# Altium schematic sheet MC.SchDoc
size Letter; SheetNumber: 3; SheetTotal: 5
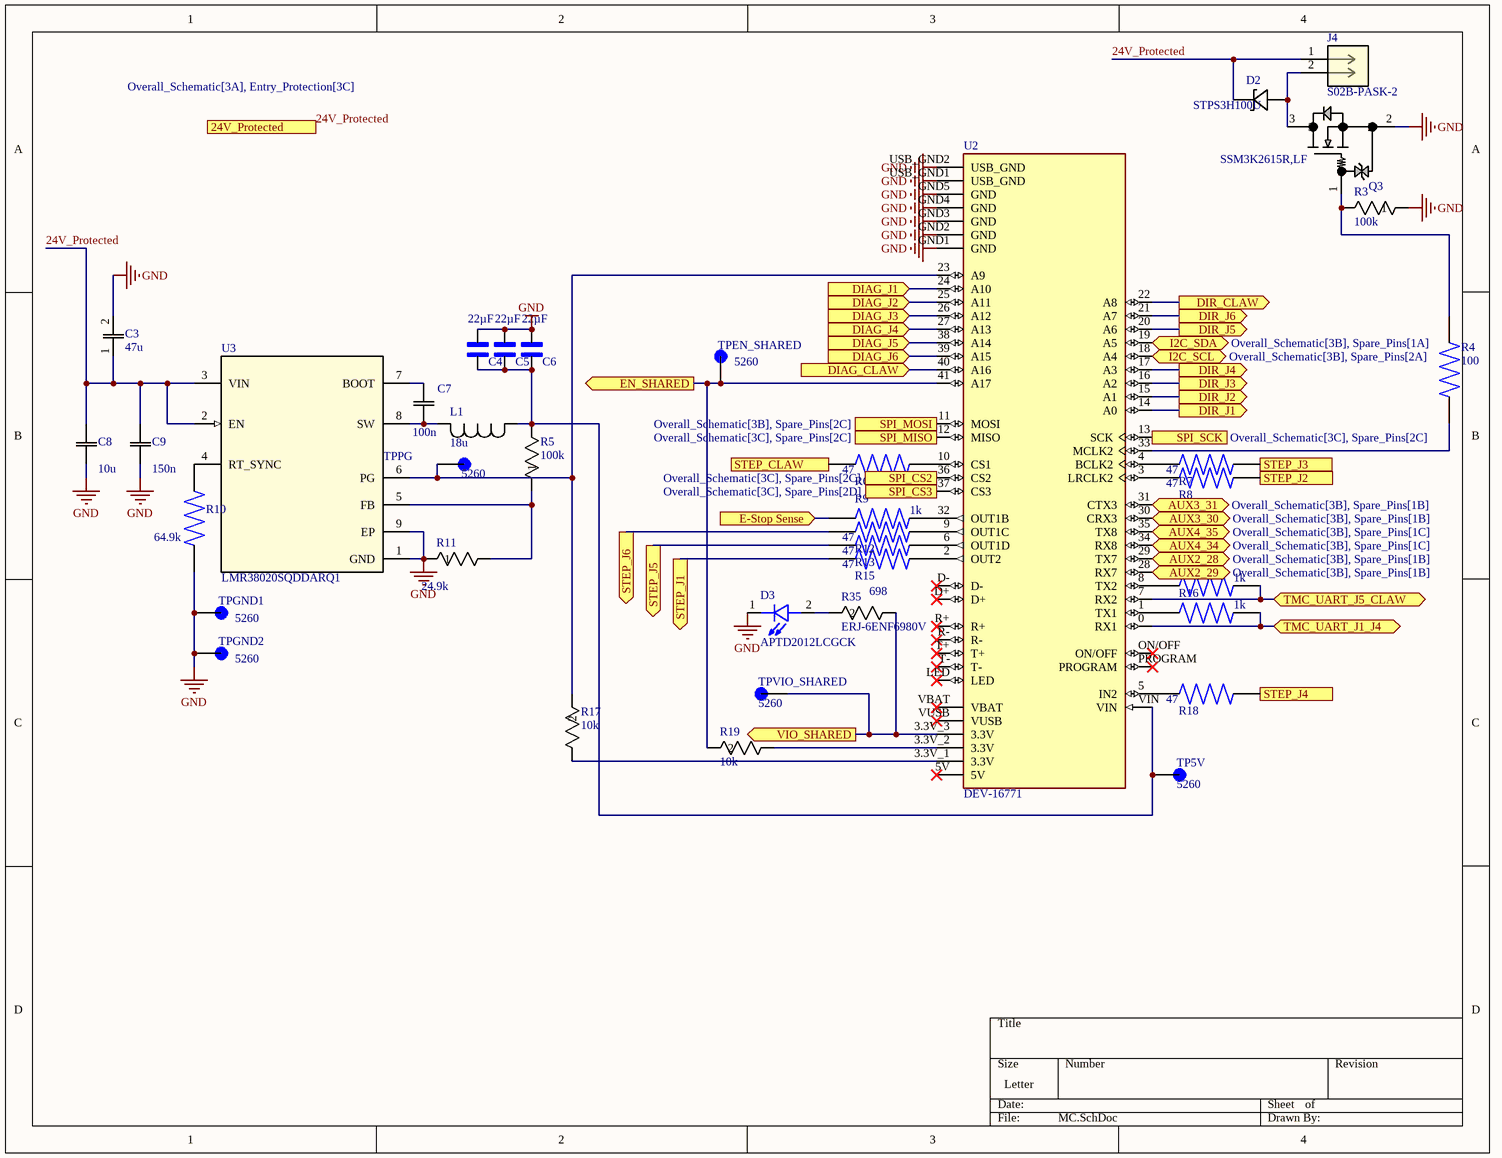
[diagram p0: MC.SchDoc]

## Parts
C3  Capacitance: 47u  [CAP_EEUFC_63X112_PAN]  (hidden comment: EEUFR1J470)
C4  Capacitance: 22µF  [CAPC3225X270N]  (hidden comment: CL32B226KAJNNNE)
C5  Capacitance: 22µF  [CAPC3225X270N]  (hidden comment: CL32B226KAJNNNE)
C6  Capacitance: 22µF  [CAPC3225X270N]  (hidden comment: CL32B226KAJNNNE)
C7  Capacitance: 100n  [CAP_CL_21_SAM]  (hidden comment: CL21B104KCCWPNC)
C8  Capacitance: 10u  [CAP_22201C106MAT2A_KYO]  (hidden comment: 22201C106MAT2A)
C9  Capacitance: 150n  [CAPC220145_140N_KEM]  (hidden comment: C0805C154K1RECTU)
D2  STPS3H100U  [SMB_STM]
D3  APTD2012LCGCK  [LED_APTD2012LCGCK]
J4  S02B-PASK-2  [CONN2_S02B-PASK-2_JST]
L1  Inductance: 18u  [IND_XGL6060_COC]  (hidden comment: XGL6060-183MEC)
Q3  SSM3K2615R,LF  [SOT-23F_TOS]
R3  Resistance: 100k  [RES_ERA3V,3K_PAN]  (hidden comment: ERA-3VEB1003V)
R4  value 100  [RES_ERA3VEB1000V]  (hidden comment: ERA3VEB1000V)
R5  Resistance: 100k  [RES_ERA3V,3K_PAN]  (hidden comment: ERA-3VEB1003V)
R6  Resistance: 47  [RES_ERA3VEB47R0V]  (hidden comment: ERA3VEB47R0V)
R7  Resistance: 47  [RES_ERA3VEB47R0V]  (hidden comment: ERA3VEB47R0V)
R8  Resistance: 47  [RES_ERA3VEB47R0V]  (hidden comment: ERA3VEB47R0V)
R9  value 1k  [RES_ERA3VEB1001V]  (hidden comment: ERA3VEB1001V)
R10  Resistance: 64.9k  [RES_ERJ3EKF6492V]  (hidden comment: ERJ3EKF6492V)
R11  Resistance: 24.9k  [RES_ERA3V,3K_PAN]  (hidden comment: ERA-3VEB2492V)
R12  Resistance: 47  [RES_ERA3VEB47R0V]  (hidden comment: ERA3VEB47R0V)
R13  Resistance: 47  [RES_ERA3VEB47R0V]  (hidden comment: ERA3VEB47R0V)
R14  value 1k  [RES_ERA3VEB1001V]  (hidden comment: ERA3VEB1001V)
R15  Resistance: 47  [RES_ERA3VEB47R0V]  (hidden comment: ERA3VEB47R0V)
R16  value 1k  [RES_ERA3VEB1001V]  (hidden comment: ERA3VEB1001V)
R17  Resistance: 10k  [RC0603N_PAN]  (hidden comment: ERJ-3EKF1002V)
R18  Resistance: 47  [RES_ERA3VEB47R0V]  (hidden comment: ERA3VEB47R0V)
R19  Resistance: 10k  [RC0603N_PAN]  (hidden comment: ERJ-3EKF1002V)
R35  ERJ-6ENF6980V  Resistance: 698  [RC0805N_PAN]
TP5V  5260  [KEYSTONE_5260]
TPEN_SHARED  5260  [KEYSTONE_5260]
TPGND1  5260  [KEYSTONE_5260]
TPGND2  5260  [KEYSTONE_5260]
TPPG  5260  [KEYSTONE_5260]
TPVIO_SHARED  5260  [KEYSTONE_5260]
U2  DEV-16771  [MODULE_DEV-16771]
U3  LMR38020SQDDARQ1  [DDA0008E-IPC_A]

## Ports
24V_Protected (in, see Overall_Schematic[3A], Entry_Protection[3C]), AUX2_28 (bidir, see Overall_Schematic[3B], Spare_Pins[1B]), AUX2_29 (bidir, see Overall_Schematic[3B], Spare_Pins[1B]), AUX3_30 (bidir, see Overall_Schematic[3B], Spare_Pins[1B]), AUX3_31 (bidir, see Overall_Schematic[3B], Spare_Pins[1B]), AUX4_34 (bidir, see Overall_Schematic[3B], Spare_Pins[1C]), AUX4_35 (bidir, see Overall_Schematic[3B], Spare_Pins[1C]), DIAG_CLAW (in, see Overall_Schematic[3C], Ｄｒｉｖｅｒｓ[4C]), DIAG_J1 (in, see Overall_Schematic[3B], Ｄｒｉｖｅｒｓ[1B]), DIAG_J2 (in, see Overall_Schematic[3C], Ｄｒｉｖｅｒｓ[2B]), DIAG_J3 (in, see Overall_Schematic[3C], Ｄｒｉｖｅｒｓ[3B]), DIAG_J4 (in, see Overall_Schematic[3C], Ｄｒｉｖｅｒｓ[4B]), DIAG_J5 (in, see Overall_Schematic[3C], Ｄｒｉｖｅｒｓ[1D]), DIAG_J6 (in, see Overall_Schematic[3C], Ｄｒｉｖｅｒｓ[2D]), DIR_CLAW (out, see Overall_Schematic[3B], Ｄｒｉｖｅｒｓ[3C]), DIR_J1 (out, see Overall_Schematic[3B], Ｄｒｉｖｅｒｓ[1B]), DIR_J2 (out, see Overall_Schematic[3B], Ｄｒｉｖｅｒｓ[2B]), DIR_J3 (out, see Overall_Schematic[3B], Ｄｒｉｖｅｒｓ[3B]), DIR_J4 (out, see Overall_Schematic[3B], Ｄｒｉｖｅｒｓ[4B]), DIR_J5 (out, see Overall_Schematic[3B], Ｄｒｉｖｅｒｓ[1D]), DIR_J6 (out, see Overall_Schematic[3B], Ｄｒｉｖｅｒｓ[2D]), E-Stop Sense (in, see Overall_Schematic[3A], Entry_Protection[2D]), EN_SHARED (out, see Overall_Schematic[3C], Ｄｒｉｖｅｒｓ[1A]), I2C_SCL (bidir, see Overall_Schematic[3B], Spare_Pins[2A]), I2C_SDA (bidir, see Overall_Schematic[3B], Spare_Pins[1A]), SPI_CS2 (out, see Overall_Schematic[3C], Spare_Pins[2C]), SPI_CS3 (out, see Overall_Schematic[3C], Spare_Pins[2D]), SPI_MISO (in, see Overall_Schematic[3C], Spare_Pins[2C]), SPI_MOSI (out, see Overall_Schematic[3B], Spare_Pins[2C]), SPI_SCK (out, see Overall_Schematic[3C], Spare_Pins[2C]), STEP_CLAW (out, see Overall_Schematic[3B], Ｄｒｉｖｅｒｓ[3C]), STEP_J1 (out, see Overall_Schematic[3A], Ｄｒｉｖｅｒｓ[1B]), STEP_J2 (out, see Overall_Schematic[3A], Ｄｒｉｖｅｒｓ[2B]), STEP_J3 (out, see Overall_Schematic[3A], Ｄｒｉｖｅｒｓ[2B]), STEP_J4 (out, see Overall_Schematic[3A], Ｄｒｉｖｅｒｓ[4B]), STEP_J5 (out, see Overall_Schematic[3A], Ｄｒｉｖｅｒｓ[1D]), STEP_J6 (out, see Overall_Schematic[3A], Ｄｒｉｖｅｒｓ[2D]), TMC_UART_J1_J4 (bidir, see Overall_Schematic[3A], Ｄｒｉｖｅｒｓ[1C]), TMC_UART_J5_CLAW (bidir, see Overall_Schematic[3A], Ｄｒｉｖｅｒｓ[1D]), VIO_SHARED (out, see Overall_Schematic[3C], Spare_Pins[1A], Ｄｒｉｖｅｒｓ[1A])

## Nets
GND: C3.2 C4.2 C5.2 C6.2 C8.1 C9.1 D3.1(C) Q3.2 R3.1 R10.1 R11.1 TPGND1.1(TP) TPGND2.1(TP) U2.GND1(GND) U2.GND2(GND) U2.GND3(GND) U2.GND4(GND) U2.GND5(GND) U2.USB_GND1(USB_GND) U2.USB_GND2(USB_GND) U3.1(GND) U3.9(EP)
24V_Protected: C3.1 C8.2 C9.2 D2.2(A) J4.1 U3.2(EN) U3.3(VIN) ; port 24V_Protected
AUX2_28: U2.29(TX7) ; port AUX2_28
AUX2_29: U2.28(RX7) ; port AUX2_29
AUX3_30: U2.30(CRX3) ; port AUX3_30
AUX3_31: U2.31(CTX3) ; port AUX3_31
AUX4_34: U2.34(RX8) ; port AUX4_34
AUX4_35: U2.35(TX8) ; port AUX4_35
DIAG_CLAW: U2.40(A16) ; port DIAG_CLAW
DIAG_J1: U2.24(A10) ; port DIAG_J1
DIAG_J2: U2.25(A11) ; port DIAG_J2
DIAG_J3: U2.26(A12) ; port DIAG_J3
DIAG_J4: U2.27(A13) ; port DIAG_J4
DIAG_J5: U2.38(A14) ; port DIAG_J5
DIAG_J6: U2.39(A15) ; port DIAG_J6
DIR_CLAW: U2.22(A8) ; port DIR_CLAW
DIR_J1: U2.14(A0) ; port DIR_J1
DIR_J2: U2.15(A1) ; port DIR_J2
DIR_J3: U2.16(A2) ; port DIR_J3
DIR_J4: U2.17(A3) ; port DIR_J4
DIR_J5: U2.20(A6) ; port DIR_J5
DIR_J6: U2.21(A7) ; port DIR_J6
E-Stop Sense: R9.1 ; port E-Stop Sense
EN_SHARED: R19.2 TPEN_SHARED.1(TP) U2.41(A17) ; port EN_SHARED
I2C_SCL: U2.18(A4) ; port I2C_SCL
I2C_SDA: U2.19(A5) ; port I2C_SDA
SPI_CS2: U2.36(CS2) ; port SPI_CS2
SPI_CS3: U2.37(CS3) ; port SPI_CS3
SPI_MISO: U2.12(MISO) ; port SPI_MISO
SPI_MOSI: U2.11(MOSI) ; port SPI_MOSI
SPI_SCK: U2.13(SCK) ; port SPI_SCK
STEP_CLAW: R6.1 ; port STEP_CLAW
STEP_J1: R15.1 ; port STEP_J1
STEP_J2: R8.2 ; port STEP_J2
STEP_J3: R7.2 ; port STEP_J3
STEP_J4: R18.2 ; port STEP_J4
STEP_J5: R13.1 ; port STEP_J5
STEP_J6: R12.1 ; port STEP_J6
TMC_UART_J1_J4: R16.2 U2.0(RX1) ; port TMC_UART_J1_J4
TMC_UART_J5_CLAW: R14.2 U2.7(RX2) ; port TMC_UART_J5_CLAW
VIO_SHARED: R35.1 TPVIO_SHARED.1(TP) U2.3.3V_3(3.3V) ; port VIO_SHARED
NetC4_1: C4.1 C5.1 C6.1 L1.2 R5.2 TP5V.1(TP) U2.VIN
NetC7_1: C7.1 U3.7(BOOT)
NetC7_2: C7.2 L1.1 U3.8(SW)
NetD2_1: D2.1(K) J4.2 Q3.3
NetD3_2: D3.2(A) R35.2
NetQ3_1: Q3.1 R3.2 R4.2
NetR4_1: R4.1 U2.33(MCLK2)
NetR5_1: R5.1 R11.2 U3.5(FB)
NetR6_2: R6.2 U2.10(CS1)
NetR7_1: R7.1 U2.4(BCLK2)
NetR8_1: R8.1 U2.3(LRCLK2)
NetR9_2: R9.2 U2.32(OUT1B)
NetR10_2: R10.2 U3.4(RT_SYNC)
NetR12_2: R12.2 U2.9(OUT1C)
NetR13_2: R13.2 U2.6(OUT1D)
NetR14_1: R14.1 U2.8(TX2)
NetR15_2: R15.2 U2.2(OUT2)
NetR16_1: R16.1 U2.1(TX1)
NetR17_1: R17.1 U2.3.3V_1(3.3V)
NetR17_2: R17.2 TPPG.1(TP) U2.23(A9) U3.6(PG)
NetR18_1: R18.1 U2.5(IN2)
NetR19_1: R19.1 U2.3.3V_2(3.3V)

Not connected (* = marked no-connect by the designer): U2 5V* D+* D-* LED* ON/OFF* PROGRAM* R+* R-* T+* T-* VBAT* VUSB*

## Library data of the parts
C3 = EEUFR1J470: Description; Manufacturer_Name: Panasonic; Copyright: Copyright (C) 2026 Ultra Librarian. All rights reserved.; Manufacturer_Part_Number: EEUFR1J470
C4-C6 = CMP-001-00083-1: 22 ÂµF Â±10% 25V Ceramic Capacitor X7R 1210 (3225 Metric); MF: Samsung Electro-Mechanics; Source: CL32B226KAJNNNE.SchLib; Component Type: Standard; Pins: 2; Case/Package: SMD-2 Samsung; Check_prices: https://www.snapeda.com/parts/CL32B226KAJNNNE/Samsung/view-part/?ref=eda; MP: CL32B226KAJNNNE; Design Item ID: CL32B226KAJNNNE; SnapEDA_Link: https://www.snapeda.com/parts/CL32B226KAJNNNE/Samsung/view-part/?ref=snap
C7 = CL21B104KCCWPNC: No Description Available; Manufacturer_Name: Samsung; Copyright: Copyright (C) 2026 Ultra Librarian. All rights reserved.; Manufacturer_Part_Number: CL21B104KCCWPNC
C8 = 22201C106MAT2A: Description; Manufacturer_Name: KYOCERA AVX; Copyright: Copyright (C) 2026 Ultra Librarian. All rights reserved.; Manufacturer_Part_Number: 22201C106MAT2A
C9 = C0805C154K1RECTU: ESD SMD Comm X7R, Ceramic, 0.15 uF, 10%, 100 VDC, X7R, SMD, MLCC, Temperature Stable, Electro Static Discharge, Class II, 0805; Manufacturer_Name: Kemet; Copyright: Copyright (C) 2026 Ultra Librarian. All rights reserved.; Manufacturer_Part_Number: C0805C154K1RECTU
D2 = STPS3H100U: 100 V, 3 A Schottky rectifier; Manufacturer_Name: STMicroelectronics; Copyright: Copyright (C) 2025 Ultra Librarian. All rights reserved.; Manufacturer_Part_Number: STPS3H100U
D3 = CMP-003-000000-1: Green 570nm LED Indication - Discrete 1.9V 0805 (2012 Metric); MF: Kingbright; Value: *; MP: APTD2012LCGCK; Check_prices: https://www.snapeda.com/parts/APTD2012LCGCK/Kingbright/view-part/?ref=eda; Source: APTD2012LCGCK.SchLib; SnapEDA_Link: https://www.snapeda.com/parts/APTD2012LCGCK/Kingbright/view-part/?ref=snap; Component Type: Standard; Pin Count: 2; Design Item ID: APTD2012LCGCK; Package: 0805 Kingbright
J4 = S02B-PASK-2: Description; Manufacturer_Name: JST; Copyright: Copyright (C) 2026 Ultra Librarian. All rights reserved.; Manufacturer_Part_Number: S02B-PASK-2; RefDes: RefDes; Type: Type
L1 = XGL6060-183MEC: Description; Manufacturer_Name: Coilcraft; Copyright: Copyright (C) 2026 Ultra Librarian. All rights reserved.; Manufacturer_Part_Number: XGL6060-183MEC
Q3 = SSM3K2615R,LF: N-ch MOSFET, 60 V, 2.0 A, 0.3 Î©@10V, SOT-23F; Manufacturer_Name: Toshiba Electronic Devices & Storage Corp.; Copyright: Copyright (C) 2026 Ultra Librarian. All rights reserved.; Manufacturer_Part_Number: SSM3K2615R,LF; Datasheet: https://toshiba.semicon-storage.com/info/docget.jsp?did=15659&prodName=SSM3K2615R; RefDes: Refdes; Type: Type
R3 R5 = ERA-3VEB1003V: No Description Available; Manufacturer_Name: Panasonic; Copyright: Copyright (C) 2026 Ultra Librarian. All rights reserved.; Manufacturer_Part_Number: ERA-3VEB1003V
R4 = CMP-009-00180-1: Design Item ID: ERA3VEB1000V; MP: ERA3VEB1000V; Component Type: Standard; Pins: 2; Availability: Unavailable; Source: ERA3VEB1000V.SchLib; Case/Package: None; Price: None
R6-R8 R12 R13 R15 R18 = CMP-009-00179-1: MP: ERA3VEB47R0V; Component Type: Standard; Pins: 2; Source: ERA3VEB47R0V.SchLib; Price: None; Availability: Unavailable; Design Item ID: ERA3VEB47R0V; Case/Package: None
R9 R14 R16 = CMP-009-00178-1: Case/Package: None; Source: ERA3VEB1001V.SchLib; Price: None; Pins: 2; Availability: Unavailable; MP: ERA3VEB1001V; Design Item ID: ERA3VEB1001V; Component Type: Standard
R10 = CMP-009-00177-1: MF: {'manufacturer': u'Panasonic Electronic Components'}; Case/Package: None; Availability: Unavailable; Price: None; Component Type: Standard; MP: ERJ3EKF6492V; Source: ERJ3EKF6492V.SchLib; Design Item ID: ERJ3EKF6492V; Pins: 2
R11 = ERA-3VEB2492V: No Description Available; Manufacturer_Name: Panasonic; Copyright: Copyright (C) 2026 Ultra Librarian. All rights reserved.; Manufacturer_Part_Number: ERA-3VEB2492V
R17 R19 = ERJ-3EKF1002V: SMD-Resistor, 0603, 0,063W, 1%, 100ppm; Manufacturer_Name: Panasonic; Copyright: Copyright (C) 2025 Ultra Librarian. All rights reserved.; Manufacturer_Part_Number: ERJ-3EKF1002V
R35 = ERJ-6ENF6980V: No Description Available; Manufacturer_Name: Panasonic; Copyright: Copyright (C) 2026 Ultra Librarian. All rights reserved.; Manufacturer_Part_Number: ERJ-6ENF6980V
TP5V TPEN_SHARED TPGND1 TPGND2 TPPG TPVIO_SHARED = CMP-007-000000-1: TEST POINT (RED) - MINIATURE; MF: Keystone Electronics; MP: 5260; Source: 5260.SchLib; Check_prices: https://www.snapeda.com/parts/5260/Keystone/view-part/?ref=eda; SnapEDA_Link: https://www.snapeda.com/parts/5260/Keystone/view-part/?ref=snap; Package: None; Pin Count: 1; Value: *; Design Item ID: 5260; Component Type: Standard
U2 = CMP-003-000000-1: RT1062 Teensy 4.1 series ARM® Cortex®-M7 MPU Embedded Evaluation Board; MF: SparkFun Electronics; Source: DEV-16771.SchLib; Design Item ID: DEV-16771; Pin Count: 65; Value: *; Check_prices: https://www.snapeda.com/parts/DEV-16771/SparkFun+Electronics/view-part/?ref=eda; Component Type: Standard; SnapEDA_Link: https://www.snapeda.com/parts/DEV-16771/SparkFun+Electronics/view-part/?ref=snap; Package: None; MP: DEV-16771
U3 = LMR38020SQDDARQ1: Automotive SIMPLE SWITCHERÂ® power converter 4.2-V to 80-V, 2-A, synchronous buck converter 8-SO PowerPAD -40 to 150; Manufacturer_Name: Texas Instruments; Copyright: Copyright (C) 2025 Ultra Librarian. All rights reserved.; Manufacturer_Part_Number: LMR38020SQDDARQ1; RefDes: >Name; TYPE: >Value